# Altium project PCB_Shield.PrjPcb
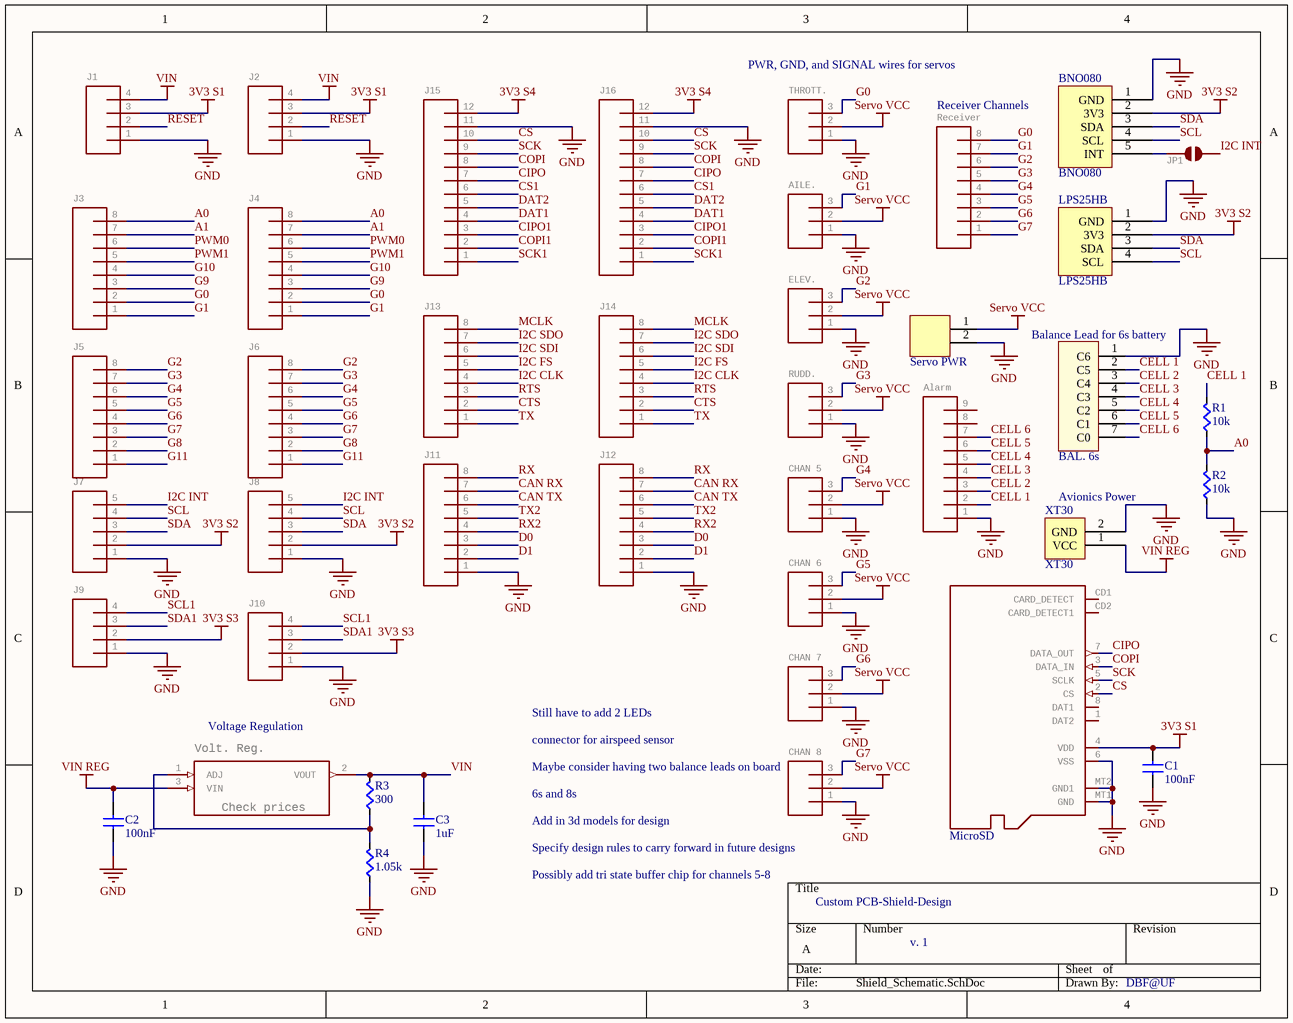
[diagram p0: Shield_Schematic.SchDoc]
1 sheet, 41 parts. Net scope: global (net labels, ports and power ports of the same name join across sheets).
Board file: PCB_Shield_v1.PcbDoc

## Sheet Shield_Schematic.SchDoc
size A; SheetNumber: 1; SheetTotal: 1

### Parts
AILE.  (no value)  [1X03_NO_SILK]
Alarm  (no value)  [1X09_NO_SILK]
BAL._6s  JST1x7  [JST1x7]  (value not drawn)
BNO080  BNO080  [PCBComponent_1]
C1  value 100nF  [CAPC0603]  (hidden comment: Cap)
C2  value 100nF  [CAPC0603]  (hidden comment: Cap)
C3  value 1uF  [CAPC0603]  (hidden comment: Cap)
CHAN_5  (no value)  [1X03_NO_SILK]
CHAN_6  (no value)  [1X03_NO_SILK]
CHAN_7  (no value)  [1X03_NO_SILK]
CHAN_8  (no value)  [1X03_NO_SILK]
ELEV.  (no value)  [1X03_NO_SILK]
J1  (no value)  [1X04_NO_SILK]
J2  (no value)  [1X04_NO_SILK]
J3  (no value)  [1X08_NO_SILK]
J4  (no value)  [1X08_NO_SILK]
J5  (no value)  [1X08_NO_SILK]
J6  (no value)  [1X08_NO_SILK]
J7  (no value)  [1X05_NO_SILK]
J8  (no value)  [1X05_NO_SILK]
J9  (no value)  [1X04_NO_SILK]
J10  (no value)  [1X04_NO_SILK]
J11  (no value)  [1X08_NO_SILK]
J12  (no value)  [1X08_NO_SILK]
J13  (no value)  [1X08_NO_SILK]
J14  (no value)  [1X08_NO_SILK]
J15  (no value)  [1X12_NO_SILK]
J16  (no value)  [1X12_NO_SILK]
JP1  (no value)  [SMT-JUMPER_2_NO_SILK]
LPS25HB  LPS25HB  [PCBComponent_1]
MicroSD  Micro-SD / Transflash card holder with SPI pinout   For the 3M # 2908-05WB-MG and/or 4UCON #19656 push-push type  [MICROSD]  (value not drawn)
R1  value 10k  [RES0603]  (hidden comment: Res)
R2  value 10k  [RES0603]  (hidden comment: Res)
R3  value 300  [RES0603]  (hidden comment: Res)
R4  value 1.05k  [RES0603]  (hidden comment: Res)
Receiver  (no value)  [1X08_NO_SILK]
RUDD.  (no value)  [1X03_NO_SILK]
Servo_PWR  2-pin Vert Sherlock  [MOLEX-HDR-1X2-SHERLOCK-VERT]  (value not drawn)
THROTT.  (no value)  [1X03_NO_SILK]
Volt._Reg.  Check prices  [TO254P1054X470X1955-3]
XT30  XT30  [PCBComponent_1]

### Nets
3V3 S1: C1.1(A) J1.3 J2.3 MicroSD.4(VDD)
3V3 S2: BNO080.2(3V3) J7.2 J8.2 LPS25HB.2(3V3)
3V3 S3: J9.2 J10.2
3V3 S4: J15.12 J16.12
GND: AILE..1 Alarm.1 BAL._6s.1(C6) BNO080.1(GND) C1.2(B) C2.2(B) C3.2(B) CHAN_5.1 CHAN_6.1 CHAN_7.1 CHAN_8.1 ELEV..1 J1.1 J2.1 J7.1 J8.1 J9.1 J10.1 J11.1 J12.1 J15.11 J16.11 LPS25HB.1(GND) MicroSD.6(VSS) MicroSD.MT1(GND) MicroSD.MT2(GND1) R2.2(B) R4.2(B) RUDD..1 Servo_PWR.2 THROTT..1 XT30.2(GND)
Servo VCC: AILE..2 CHAN_5.2 CHAN_6.2 CHAN_7.2 CHAN_8.2 ELEV..2 RUDD..2 Servo_PWR.1 THROTT..2
VIN: C3.1(A) J1.4 J2.4 R3.1(A) Volt._Reg..2(VOUT)
VIN REG: C2.1(A) Volt._Reg..3(VIN) XT30.1(VCC)
A0: J3.8 J4.8 R1.2(B) R2.1(A)
A1: J3.7 J4.7
CAN RX: J11.7 J12.7
CAN TX: J11.6 J12.6
CELL 1: Alarm.2 BAL._6s.2(C5) R1.1(A)
CELL 2: Alarm.3 BAL._6s.3(C4)
CELL 3: Alarm.4 BAL._6s.4(C3)
CELL 4: Alarm.5 BAL._6s.5(C2)
CELL 5: Alarm.6 BAL._6s.6(C1)
CELL 6: Alarm.7 BAL._6s.7(C0)
CIPO: J15.7 J16.7 MicroSD.7(DATA_OUT)
CIPO1: J15.3 J16.3
COPI: J15.8 J16.8 MicroSD.3(DATA_IN)
COPI1: J15.2 J16.2
CS: J15.10 J16.10 MicroSD.2(CS)
CS1: J15.6 J16.6
CTS: J13.2 J14.2
D0: J11.3 J12.3
D1: J11.2 J12.2
DAT1: J15.4 J16.4
DAT2: J15.5 J16.5
G0: J3.2 J4.2 Receiver.8 THROTT..3
G1: AILE..3 J3.1 J4.1 Receiver.7
G2: ELEV..3 J5.8 J6.8 Receiver.6
G3: J5.7 J6.7 Receiver.5 RUDD..3
G4: CHAN_5.3 J5.6 J6.6 Receiver.4
G5: CHAN_6.3 J5.5 J6.5 Receiver.3
G6: CHAN_7.3 J5.4 J6.4 Receiver.2
G7: CHAN_8.3 J5.3 J6.3 Receiver.1
G8: J5.2 J6.2
G9: J3.3 J4.3
G10: J3.4 J4.4
G11: J5.1 J6.1
I2C CLK: J13.4 J14.4
I2C FS: J13.5 J14.5
I2C INT: J7.5 J8.5 JP1.2
I2C SDI: J13.6 J14.6
I2C SDO: J13.7 J14.7
MCLK: J13.8 J14.8
PWM0: J3.6 J4.6
PWM1: J3.5 J4.5
RESET: J1.2 J2.2
RTS: J13.3 J14.3
RX: J11.8 J12.8
RX2: J11.4 J12.4
SCK: J15.9 J16.9 MicroSD.5(SCLK)
SCK1: J15.1 J16.1
SCL: BNO080.4(SCL) J7.4 J8.4 LPS25HB.4(SCL)
SCL1: J9.4 J10.4
SDA: BNO080.3(SDA) J7.3 J8.3 LPS25HB.3(SDA)
SDA1: J9.3 J10.3
TX: J13.1 J14.1
TX2: J11.5 J12.5
NetBNO080_5: BNO080.5(INT) JP1.1
NetR3_2: R3.2(B) R4.1(A) Volt._Reg..1(ADJ)

Not connected (* = marked no-connect by the designer): Alarm 8 9; MicroSD 1(DAT2) 8(DAT1) CD1(CARD_DETECT) CD2(CARD_DETECT1)

### Notes on the sheet
- (near THROTT.) PWR, GND, and SIGNAL wires for servos
- (near Receiver) Receiver Channels
- (near BAL._6s) Balance Lead for 6s battery
- (near XT30) Avionics Power
- Voltage Regulation
- Still have to add 2 LEDs
- connector for airspeed sensor
- (near CHAN_8) Maybe consider having two balance leads on board
- 6s and 8s
- Add in 3d models for design
- (near CHAN_8) Specify design rules to carry forward in future designs
- Possibly add tri state buffer chip for channels 5-8
- Custom PCB-Shield-Design
- v. 1
- DBF@UF

### Library data of the parts
AILE. CHAN_5-CHAN_8 ELEV. RUDD. THROTT. = CONN_031X03_NO_SILK: GateName_1: J$1; SymbolName_1: CONN_03; DeviceName: 1X03_NO_SILK; LibraryName: SparkFun-Connectors; DeviceSetName: CONN_03; Package: 1X03_NO_SILK
Alarm = CONN_09NO_SILK: GateName_1: J1; SymbolName_1: CONN_09; DeviceName: NO_SILK; LibraryName: SparkFun-Connectors; DeviceSetName: CONN_09; Package: 1X09_NO_SILK
BAL._6s = JST1x7: CONN HEADER XH SIDE 7POS 2.5MM; Supplier 1: Digi-Key; Supplier Part Number 1: 455-2240-ND
BNO080 = BNO080: BNO080 Breakout Board
J1 J2 J9 J10 = CONN_041X04_NO_SILK: GateName_1: J1; PROD_ID: CONN-09696; SymbolName_1: CONN_04; DeviceName: 1X04_NO_SILK; LibraryName: SparkFun-Connectors; DeviceSetName: CONN_04; Package: 1X04_NO_SILK
J3-J6 J11-J14 Receiver = CONN_08NO_SILK_FEMALE_PTH: GateName_1: G$1; PROD_ID: CONN-08438; SymbolName_1: CONN_08; DeviceName: NO_SILK_FEMALE_PTH; LibraryName: SparkFun-Connectors; DeviceSetName: CONN_08; Package: 1X08_NO_SILK
J7 J8 = CONN_05NO_SILK: GateName_1: G$1; SymbolName_1: CONN_05; DeviceName: NO_SILK; LibraryName: SparkFun-Connectors; DeviceSetName: CONN_05; Package: 1X05_NO_SILK
J15 J16 = CONN_12NO_SILK: GateName_1: G$1; SymbolName_1: CONN_12; DeviceName: NO_SILK; LibraryName: SparkFun-Connectors; DeviceSetName: CONN_12; Package: 1X12_NO_SILK
JP1 = JUMPER-SMT_2_NO_SILK: GateName_1: G$1; SymbolName_1: SMT-JUMPER_2_NO; DeviceName: _SILK; LibraryName: SparkFun-Jumpers; DeviceSetName: JUMPER-SMT_2_NO; Package: SMT-JUMPER_2_NO_SILK
LPS25HB = LPS25HB: LPS25HB Breakout Board
MicroSD = MICROSD: GateName_1: G$1; SymbolName_1: TRANSFLASH; LibraryName: adafruit; DeviceSetName: MICROSD; Package: MICROSD
Servo_PWR = MOLEX-HDR-1x2-SHERLOCK_VERT: Header, Molex, 2mm Pitch Sherlock Header, Single Row, Vertical, 2 Circuits, Length 3.3mm, 0353620250; Manufacturer Part Number: *; Order Part Number: *
Volt._Reg. = LM338T: GateName_1: G$1; MP: LM338T/NOPB; MF: Texas Instruments; SymbolName_1: LM338T; LibraryName: LM338T; DeviceSetName: LM338T; Package: TO-220-3 Texas Instruments; Price: None; Purchase-URL: https://pricing.snapeda.com/search/part/LM338T/NOPB/?ref=eda; Availability: Warning
C1-C3 = Cap: Supplier 1: Digi-Key; Supplier Part Number 1: 1276-1000-1-ND
R1-R4 = Res: Supplier 1: Digi-Key; Supplier Part Number 1: RMCF0603JT10K0CT-ND